# EAGLE design NanoLogger (EAGLE 7.2.0)
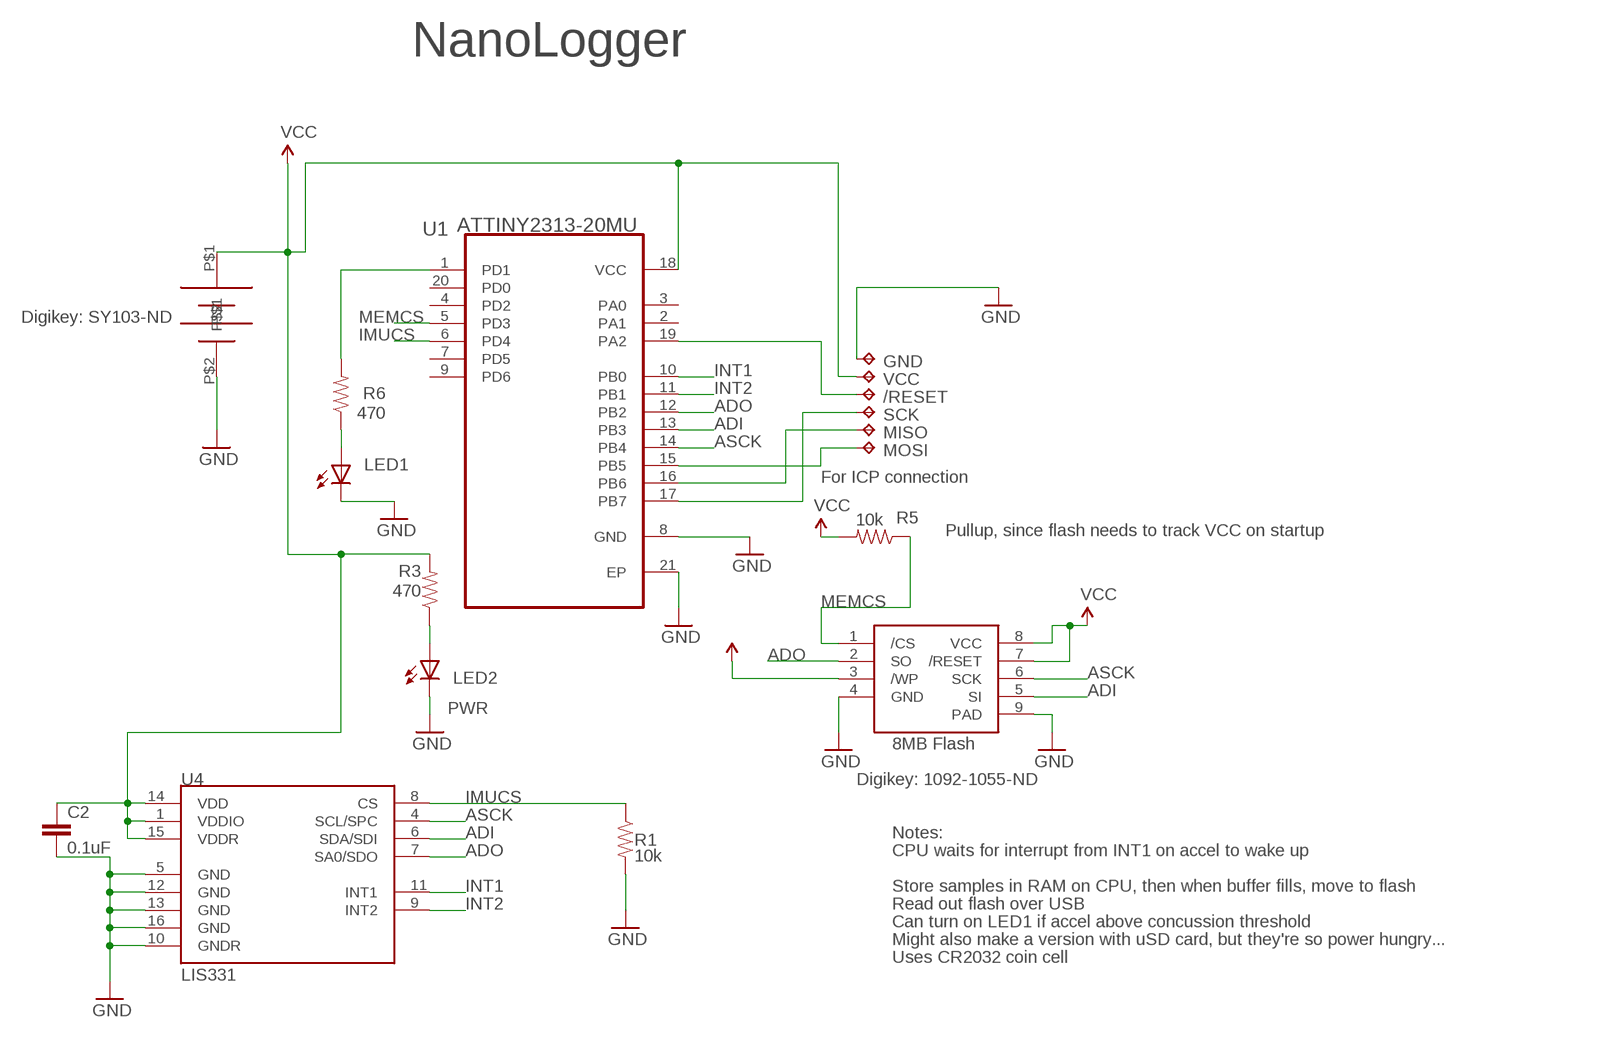
[diagram p0: schematic, sheet 1]

## Parts
/RESET  TPTP08R  [TP08R]
C2  0.1uF  CAP0402-CAP  [0402-CAP]
GND  TPTP08R  [TP08R]
LED1  LED0603  [LED-0603]
LED2  LED0603  [LED-0603]
MISO  TPTP08R  [TP08R]
MOSI  TPTP08R  [TP08R]
R1  10k  RESISTOR0402-RES  [0402-RES]
R3  470  RESISTOR0402-RES  [0402-RES]
R5  10k  RESISTOR0402-RES  [0402-RES]
R6  470  RESISTOR0402-RES  [0402-RES]
SCK  TPTP08R  [TP08R]
U1  ATTINY2313-20MU  [QFN50P400X400X80-21N]
U4  LIS331  [LGA16-3MM]
U$1  ML621-TZ1  [ML621-TZ1]
U$2  MX25U8035EZUI-10G  [MX25U8035EZUI-10G]
VCC  TPTP08R  [TP08R]

## Nets
ADI: U1.13(PB3) U4.6(SDA/SDI) U$2.5(SI)
ADO: U1.12(PB2) U4.7(SA0/SDO) U$2.2(SO)
ASCK: U1.14(PB4) U4.4(SCL/SPC) U$2.6(SCK)
GND: C2.2 GND.TP LED1.C LED2.C R1.2 U1.8(GND) U1.21(EP) U4.5(GND) U4.10(GNDR) U4.12(GND) U4.13(GND) U4.16(GND) U$1.P$2 U$2.4(GND) U$2.9(PAD)
IMUCS: R1.1 U1.6(PD4) U4.8(CS)
INT1: U1.10(PB0) U4.11(INT1)
INT2: U1.11(PB1) U4.9(INT2)
MEMCS: R5.1 U1.5(PD3) U$2.1(/CS)
N$1: R6.2 U1.1(PD1)
N$2: /RESET.TP U1.19(PA2)
N$3: LED2.A R3.1
N$8: SCK.TP U1.17(PB7)
N$10: LED1.A R6.1
N$12: MISO.TP U1.16(PB6)
N$13: MOSI.TP U1.15(PB5)
VCC: C2.1 R3.2 R5.2 U1.18(VCC) U4.1(VDDIO) U4.14(VDD) U4.15(VDDR) U$1.P$1 U$2.3(/WP) U$2.7(/RESET) U$2.8(VCC) VCC.TP
Unconnected: U1.2(PA1) U1.3(PA0) U1.4(PD2) U1.7(PD5) U1.9(PD6) U1.20(PD0)

## Notes on the sheet
- NanoLogger
- Digikey: SY103-ND
- For ICP connection
- Pullup, since flash needs to track VCC on startup
- PWR
- 8MB Flash
- Digikey: 1092-1055-ND
- Notes:
- CPU waits for interrupt from INT1 on accel to wake up
- Store samples in RAM on CPU, then when buffer fills, move to flash
- Read out flash over USB
- Can turn on LED1 if accel above concussion threshold
- Might also make a version with uSD card, but they're so power hungry...
- Uses CR2032 coin cell

## Library data of the parts
/RESET GND MISO MOSI SCK VCC = testpad:TP: Test pad
C2 = SparkFun:CAP: Capacitor Standard 0603 ceramic capacitor, and 0.1" leaded capacitor.
LED1 LED2 = SparkFun:LED: LEDs Standard schematic elements and footprints for 5mm, 3mm, 1206, and 0603 sized LEDs. 5mm - Spark Fun Electronics SKU : COM-00529 (and others)
R1 R3 R5 R6 = SparkFun:RESISTOR: Resistor Basic schematic elements and footprints for 0603, 1206, and PTH resistors.
U1 = ATTINY2313-20MU-208895:ATTINY2313-20MU: Microcontroller
U4 = SparkFun:LIS331: LIS331HH 3-axis accelerometer
U$1 = ML621-TZ1:ML621-TZ1
U$2 = MX25U8035EZUI-10G:MX25U8035EZUI-10G

## Board
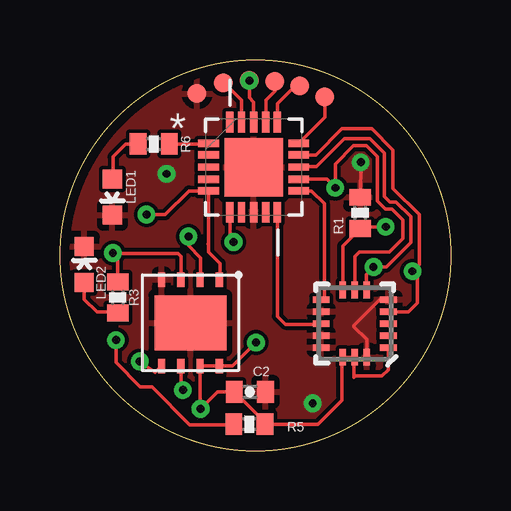
[diagram p1: board, top side]
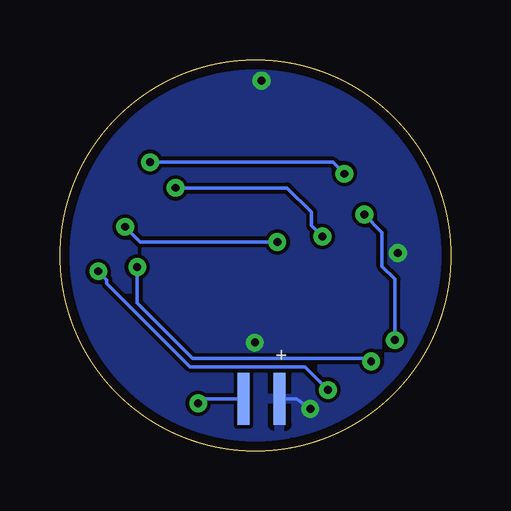
[diagram p2: board, bottom side, seen from below]

Size 16.31 x 16.31 mm. Coordinates in mm from the lower left corner, seen from the top.
Outline: circle at 8.15,8.15 radius 8.15
Copper layers (1+2*15+16): Top 0.035mm / dielectric 1.5mm / Route2 0.035mm / dielectric 0.15mm / Route15 0.035mm / dielectric 0.2mm / Bottom 0.035mm
Design rules "default *": minimum track width 5mil, minimum drill 10mil, track to track 6mil, track to pad 6mil, pad to pad 6mil, via to via 6mil, smd to smd 6mil, copper to edge 15mil, drill to drill 8mil, minimum pad ring 10mil, minimum via ring 8mil, stop-mask expansion 4mil, vias tented up to drill 15mil, thermal gap 10mil

### Footprints (pad centres in the part's own frame; a part is rotated, then mirrored left to right if it is on the bottom)
TP08R = smd 0.8 x 0.8: TP 0,0
0402-CAP = smd 0.7 x 0.9: 1 -0.65,0; 2 0.65,0
LED-0603 = smd 0.8 x 0.8: A 0,-0.75; C 0,0.75
0402-RES = smd 0.7 x 0.9: 1 -0.65,0; 2 0.65,0
QFN50P400X400X80-21N = smd 0.864 x 0.305: 1 -1.88,0.991; 2 -1.88,0.508; 3 -1.88,0; 4 -1.88,-0.508; 5 -1.88,-0.991; 11 1.88,-0.991; 12 1.88,-0.508; 13 1.88,0; 14 1.88,0.508; 15 1.88,0.991 | smd 0.305 x 0.864: 6 -0.991,-1.88; 7 -0.508,-1.88; 8 0,-1.88; 9 0.508,-1.88; 10 0.991,-1.88; 16 0.991,1.88; 17 0.508,1.88; 18 0,1.88; 19 -0.508,1.88; 20 -0.991,1.88 | smd 2.438 x 2.438: 21 0,0
LGA16-3MM = smd 0.7 x 0.28: 1 -1.4,1; 2 -1.4,0.5; 3 -1.4,0; 4 -1.4,-0.5; 5 -1.4,-1; 9 1.4,-1; 10 1.4,-0.5; 11 1.4,0; 12 1.4,0.5; 13 1.4,1 | smd 0.28 x 0.7: 6 -0.5,-1.4; 7 0,-1.4; 8 0.5,-1.4; 14 0.5,1.4; 15 0,1.4; 16 -0.5,1.4
ML621-TZ1 = smd 2.15 x 0.5: P$1 1.08,0.25; P$2 1.08,-1.25
MX25U8035EZUI-10G = smd 0.3 x 0.6: 1 0.8,0.2; 2 1.6,0.2; 3 2.4,0.2; 4 3.2,0.2; 5 3.2,3.8; 6 2.4,3.8; 7 1.6,3.8; 8 0.8,3.8 | smd 3 x 2.3: 9 2,2

### Placement (x,y rotation side)
/RESET  6.81,15.34 0 top
C2  7.92,2.46 0 top
GND  5.71,14.91 0 top
LED1  2.18,10.59 180 top
LED2  1.02,7.77 0 top
MISO  10.01,15.21 0 top
MOSI  11.05,14.76 0 top
R1  12.52,9.93 90 top
R3  2.41,6.4 90 top
R5  7.9,1.12 359.8 top
R6  3.91,12.8 0 top
SCK  8.97,15.42 0 top
U1  8.08,11.84 0 top
U4  12.29,5.31 180 top
U$1  7.39,3.25 270 bottom
U$2  7.44,7.34 180 top
VCC  7.9,15.44 0 top

### Tracks (layer width: path | path; a pad name or v marks a point on that pad's centre or on a via)
ADI  (via drill 0.33)
  Top 0.152: U4.6 12.78,6.73 12.78,7.37 v13.08,7.67 13.61,7.67 14.63,8.69 14.63,9.78 14.02,10.39 13.77,10.39 13.54,10.62 13.54,12.42 12.93,13.03 11.86,13.03 10.69,11.86 9.98,11.86 U1.13 | v3.33,3.73 3.98,3.28 U$2.5
  Bottom 0.152: v13.08,7.67 13.08,6.17 10.77,3.86 3.45,3.86 v3.33,3.73 3.4,3.61
ADO  (via drill 0.33)
  Top 0.152: U4.7 12.29,8.1 12.5,8.31 13.74,8.31 14.3,8.86 14.3,9.63 13.84,10.08 13.56,10.08 13.23,10.41 13.23,12.27 12.78,12.73 12.24,12.73 11.48,11.96 v11.48,10.97 11.13,11.33 U1.12 | v5.36,8.94 5.36,8.56 5.87,8.05 5.87,7.17 U$2.2
  Bottom 0.152: v11.48,10.97 6.83,10.97 5.82,9.96 5.82,9.4 v5.36,8.94
ASCK  (via drill 0.33)
  Top 0.152: U$2.6 5.04,2.63 v5.13,2.54 | U4.4 13.71,5.79 14.53,5.79 14.91,6.17 14.91,7.29 v14.71,7.49 14.99,7.77 14.99,9.86 13.89,10.95 13.89,12.55 13,13.44 11.76,13.44 10.67,12.34 U1.14 9.98,12.32
  Bottom 0.152: v5.13,2.54 6.1,3.51 10.87,3.51 14.35,6.98 14.35,7.14 v14.71,7.49
GND  (via drill 0.33)
  Top 0.152: U4.5 13.34,6.31 12.27,5.23 12.27,5.18 12.8,4.65 12.8,3.92 U4.16 | R1.2 v12.55,12.04 | v10.54,1.98 10.54,2.11 10.64,2.21
  Bottom 0.152: U$1.P$2 10.35,2.17 v10.54,1.98 | v4.45,11.56 4.93,12.04 v12.55,12.04
  pour Top: -1.02,-1.7 17.2,-1.7 17.2,17.09 -1.02,17.09
IMUCS  (via drill 0.33)
  Top 0.152: U4.8 11.79,8.55 R1.1 12.59,9.35 v13.59,9.35 | U1.6 7.09,8.86 v7.24,8.71
  Bottom 0.152: v7.24,8.71 12.95,8.71 v13.59,9.35
INT1
  Top 0.152: U1.10 9.07,5.61 9.4,5.28 10.87,5.28 U4.11
INT2
  Top 0.152: U1.11 10.49,10.85 11.02,10.31 11.02,6.44 U4.9
MEMCS  (via drill 0.33)
  Top 0.152: 6.2,8.61 U1.5 5.38,10.85 4.39,9.86 v3.61,9.86 | 6.2,8.61 6.2,8.31 6.68,7.82 6.68,7.18 U$2.1 | 6.17,8.64 6.2,8.61 | v2.34,4.62 2.34,3.68 3.35,2.67 3.84,2.67 5.41,1.09 7.22,1.09 R5.1
  Bottom 0.152: v2.34,4.62 2.34,7.16 2.87,7.7 2.87,9.12 v3.61,9.86
N$1
  Top 0.152: R6.2 6.17,12.8 U1.1
N$2
  Top 0.152: /RESET.TP 6.86,15.34 7.57,14.63 U1.19
N$3
  Top 0.152: LED2.A 1.02,6.32 1.55,5.79 2.37,5.79 R3.1
N$8
  Top 0.152: SCK.TP 8.97,15.01 8.59,14.63 U1.17
N$10
  Top 0.152: LED1.A 2.21,11.37 2.21,12.27 2.74,12.8 R6.1
N$12
  Top 0.152: MISO.TP 9.8,15.21 9.07,14.48 U1.16
N$13
  Top 0.152: MOSI.TP 11.05,13.92 U1.15
VCC  (via drill 0.33)
  Top 0.152: VCC.TP 7.9,14.73 8.08,14.55 U1.18 | R3.2 2.41,8.05 v2.21,8.25 2.24,8.23 4.93,8.23 5.04,8.11 U$2.3 | U$2.7 U$2.8 7.2,3.54 v8.18,4.52 | U$2.7 | U4.1 13.69,3.38 13.44,3.12 12.32,3.12 12.27,3.07 12.27,3.88 U4.15 U4.14 11.76,3.88 11.76,2.11 10.77,1.12 R5.2 8.49,1.12 8.49,1.25 C2.1 | 7.3,2.33 C2.1 | U$2.7 5.84,1.78 v5.87,1.75 6.58,2.46 C2.1
  Bottom 0.152: v2.21,8.25 2.21,8.41 2.18,8.43 | v8.18,4.52 8.18,4.78 | U$1.P$1 6.44,2.17 v5.87,1.75
  other vias: 7.9,15.44
  pour Bottom: -1.02,17.07 17.17,17.07 17.17,-1.7 -1.02,-1.7